# EAGLE design MOSFET_IF (EAGLE 7.2.0)
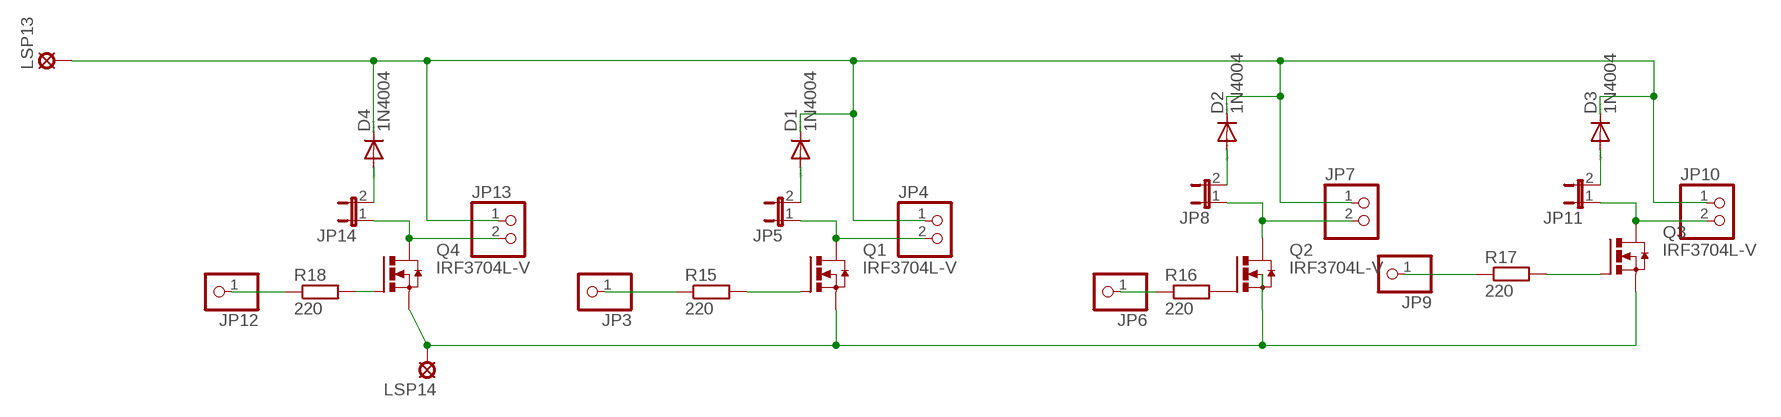
[diagram p0: schematic, sheet 1]

## Parts
D1  1N4004  [DO41-10]
D2  1N4004  [DO41-10]
D3  1N4004  [DO41-10]
D4  1N4004  [DO41-10]
JP3  PINHD-1X1  [1X01]
JP4  PINHD-1X2  [1X02]
JP5  JP1E  [JP1]
JP6  PINHD-1X1  [1X01]
JP7  PINHD-1X2  [1X02]
JP8  JP1E  [JP1]
JP9  PINHD-1X1  [1X01]
JP10  PINHD-1X2  [1X02]
JP11  JP1E  [JP1]
JP12  PINHD-1X1  [1X01]
JP13  PINHD-1X2  [1X02]
JP14  JP1E  [JP1]
LSP13  LSP10  [LSP10]
LSP14  LSP10  [LSP10]
Q1  IRF3704L-V  [TO262-V]
Q2  IRF3704L-V  [TO262-V]
Q3  IRF3704L-V  [TO262-V]
Q4  IRF3704L-V  [TO262-V]
R15  220  R-EU_0207/10  [0207/10]
R16  220  R-EU_0207/10  [0207/10]
R17  220  R-EU_0207/10  [0207/10]
R18  220  R-EU_0207/10  [0207/10]

## Nets
N$40: Q1.1(G) R15.2
N$51: JP3.1 R15.1
N$62: JP4.2 JP5.1 Q1.2(D)
N$65: D1.A JP5.2
N$67: Q2.1(G) R16.2
N$68: JP6.1 R16.1
N$69: JP7.2 JP8.1 Q2.2(D)
N$70: D2.A JP8.2
N$71: Q3.1(G) R17.2
N$72: JP9.1 R17.1
N$73: JP10.2 JP11.1 Q3.2(D)
N$74: D3.A JP11.2
N$75: Q4.1(G) R18.2
N$76: JP12.1 R18.1
N$77: JP13.2 JP14.1 Q4.2(D)
N$78: D4.A JP14.2
N$118: D1.C D2.C D3.C D4.C JP4.1 JP7.1 JP10.1 JP13.1 LSP13.MP
N$119: LSP14.MP Q1.3(S) Q2.3(S) Q3.3(S) Q4.3(S)

## Library data of the parts
D1-D4 = diode:1N4004: DIODE general purpose rectifier, 1 A
JP3 JP6 JP9 JP12 = pinhead:PINHD-1X1: PIN HEADER
JP4 JP7 JP10 JP13 = pinhead:PINHD-1X2: PIN HEADER
JP5 JP8 JP11 JP14 = jumper:JP1E: JUMPER
LSP13 LSP14 = solpad:LSP10: SOLDER PAD drill 1.0 mm, distributor Buerklin, 12H555
Q1-Q4 = transistor-power:IRF3704: SMPS MOSFET HEXFET® Power MOSFET Source: http://www.irf.com/product-info/datasheets/data/irf3704.pdf
R15-R18 = rcl:R-EU_: RESISTOR, European symbol

## Board
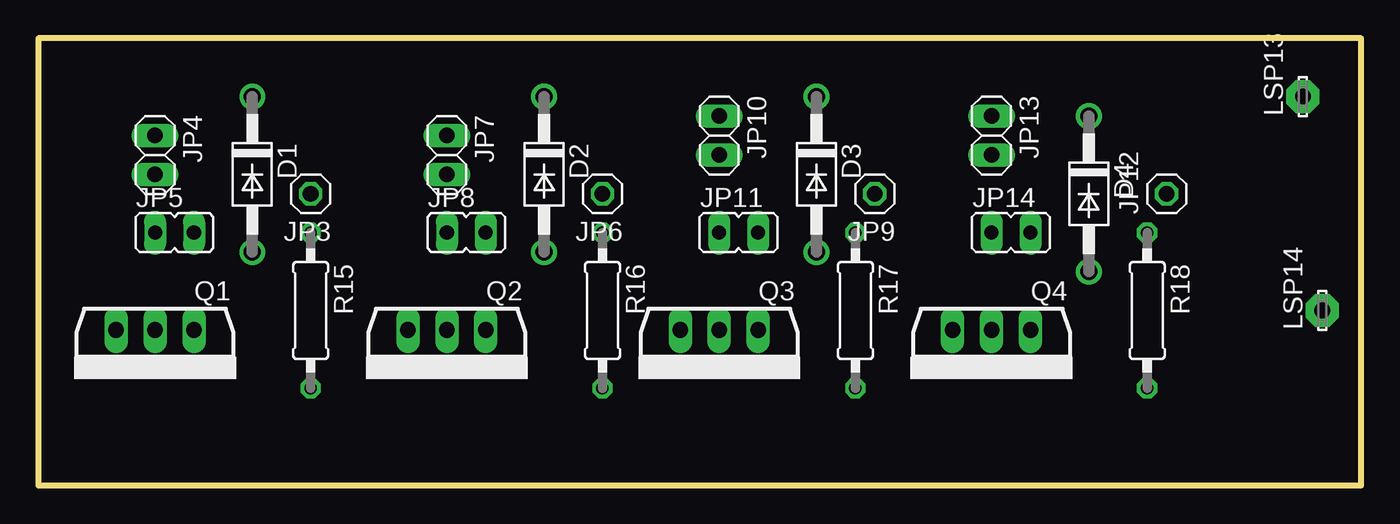
[diagram p1: board, top side]
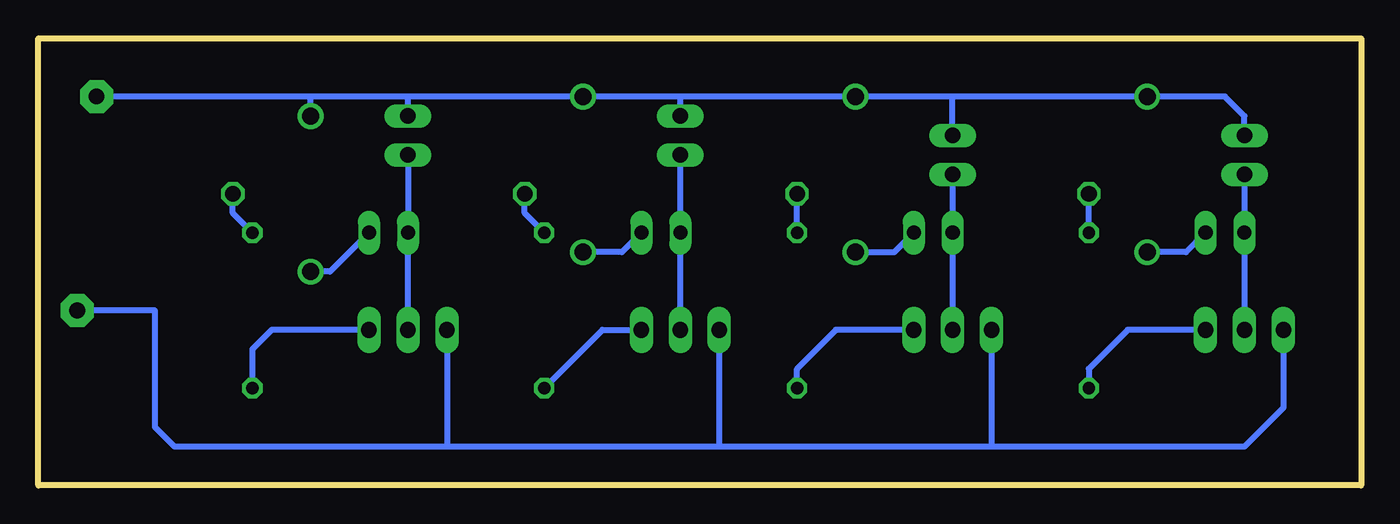
[diagram p2: board, bottom side, seen from below]

Size 86.36 x 29.21 mm. Coordinates in mm from the lower left corner, seen from the top.
Outline: 0,0 86.36,0 86.36,29.21 0,29.21 0,0
Copper layers (1*16): Top 0.035mm / dielectric 1.5mm / Bottom 0.035mm
Design rules "default": minimum track width 10mil, minimum drill 24mil, track to track 8mil, track to pad 8mil, pad to pad 8mil, via to via 8mil, smd to smd 8mil, copper to edge 40mil, drill to drill 8mil, minimum pad ring 10mil, minimum via ring 8mil, stop-mask expansion 4mil, vias tented up to drill 0mil, thermal gap 10mil

### Footprints (pad centres in the part's own frame; a part is rotated, then mirrored left to right if it is on the bottom)
DO41-10 = drill 1.118: A 5.08,0; C -5.08,0
1X01 = drill 1.016 octagon: 1 0,0
1X02 = drill 1.016 long: 1 -1.27,0; 2 1.27,0
JP1 = drill 0.914 long: 1 0,-1.27; 2 0,1.27
LSP10 = drill 1.016 pad 2.159 octagon: MP 0,0
TO262-V = drill 1.016 long: 1 -2.54,0; 2 0,0; 3 2.54,0
0207/10 = drill 0.813 octagon: 1 -5.08,0; 2 5.08,0

### Placement (x,y rotation side)
D1  13.97,20.32 270 top
D2  33.02,20.32 270 top
D3  50.8,20.32 270 top
D4  68.58,19.05 270 top
JP3  17.78,19.05 180 top
JP4  7.62,21.59 270 top
JP5  8.89,16.51 270 top
JP6  36.83,19.05 180 top
JP7  26.67,21.59 270 top
JP8  27.94,16.51 270 top
JP9  54.61,19.05 180 top
JP10  44.45,22.86 270 top
JP11  45.72,16.51 270 top
JP12  73.66,19.05 90 top
JP13  62.23,22.86 270 top
JP14  63.5,16.51 270 top
LSP13  82.55,25.4 90 top
LSP14  83.82,11.43 90 top
Q1  7.62,10.16 180 top
Q2  26.67,10.16 180 top
Q3  44.45,10.16 180 top
Q4  62.23,10.16 180 top
R15  17.78,11.43 270 top
R16  36.83,11.43 270 top
R17  53.34,11.43 270 top
R18  72.39,11.43 270 top

### Tracks (layer width: path | path; a pad name or v marks a point on that pad's centre or on a via)
N$40
  Bottom 0.406: Q1.1 15.24,10.16 17.78,7.62 R15.2
N$51
  Bottom 0.406: R15.1 JP3.1
N$62
  Bottom 0.406: JP4.2 JP5.1 Q1.2
N$65
  Bottom 0.406: JP5.2 11.43,15.24 D1.A
N$67
  Bottom 0.406: Q2.1 34.29,10.16 36.83,7.62 R16.2
N$68
  Bottom 0.406: R16.1 JP6.1
N$69
  Bottom 0.406: JP7.2 JP8.1 Q2.2
N$70
  Bottom 0.406: JP8.2 30.48,15.24 D2.A
N$71
  Bottom 0.406: R17.2 49.53,10.16 Q3.1
N$72
  Bottom 0.406: R17.1 54.61,17.78 JP9.1
N$73
  Bottom 0.406: JP10.2 JP11.1 Q3.2
N$74
  Bottom 0.406: JP11.2 48.26,15.24 D3.A
N$75
  Bottom 0.406: Q4.1 71.12,10.16 72.39,8.89 R18.2
N$76
  Bottom 0.406: R18.1 73.66,17.78 JP12.1
N$77
  Bottom 0.406: Q4.2 JP14.1 | 62.23,17.78 JP14.1 | JP13.2 JP14.1
N$78
  Bottom 0.406: JP14.2 67.31,13.97 D4.A
N$118
  Bottom 0.406: JP4.1 7.62,24.13 8.89,25.4 D1.C 26.67,25.4 | 26.67,25.4 D2.C 44.45,25.4 | JP7.1 26.67,25.4 | 44.45,25.4 D3.C 62.23,25.4 | JP10.1 44.45,25.4 | 62.23,25.4 68.58,25.4 | 68.58,25.4 LSP13.MP | D4.C 68.58,25.4 | JP13.1 62.23,25.4
N$119
  Bottom 0.406: Q1.3 5.08,5.08 7.62,2.54 24.13,2.54 | 24.13,2.54 41.91,2.54 | 41.91,2.54 59.69,2.54 | 59.69,2.54 77.47,2.54 78.74,3.81 78.74,11.43 LSP14.MP | Q2.3 24.13,2.54 | Q3.3 41.91,2.54 | Q4.3 59.69,2.54